# EAGLE schematic prism (EAGLE 6.5.0)
Assembly variants: Master Xbee, Slave
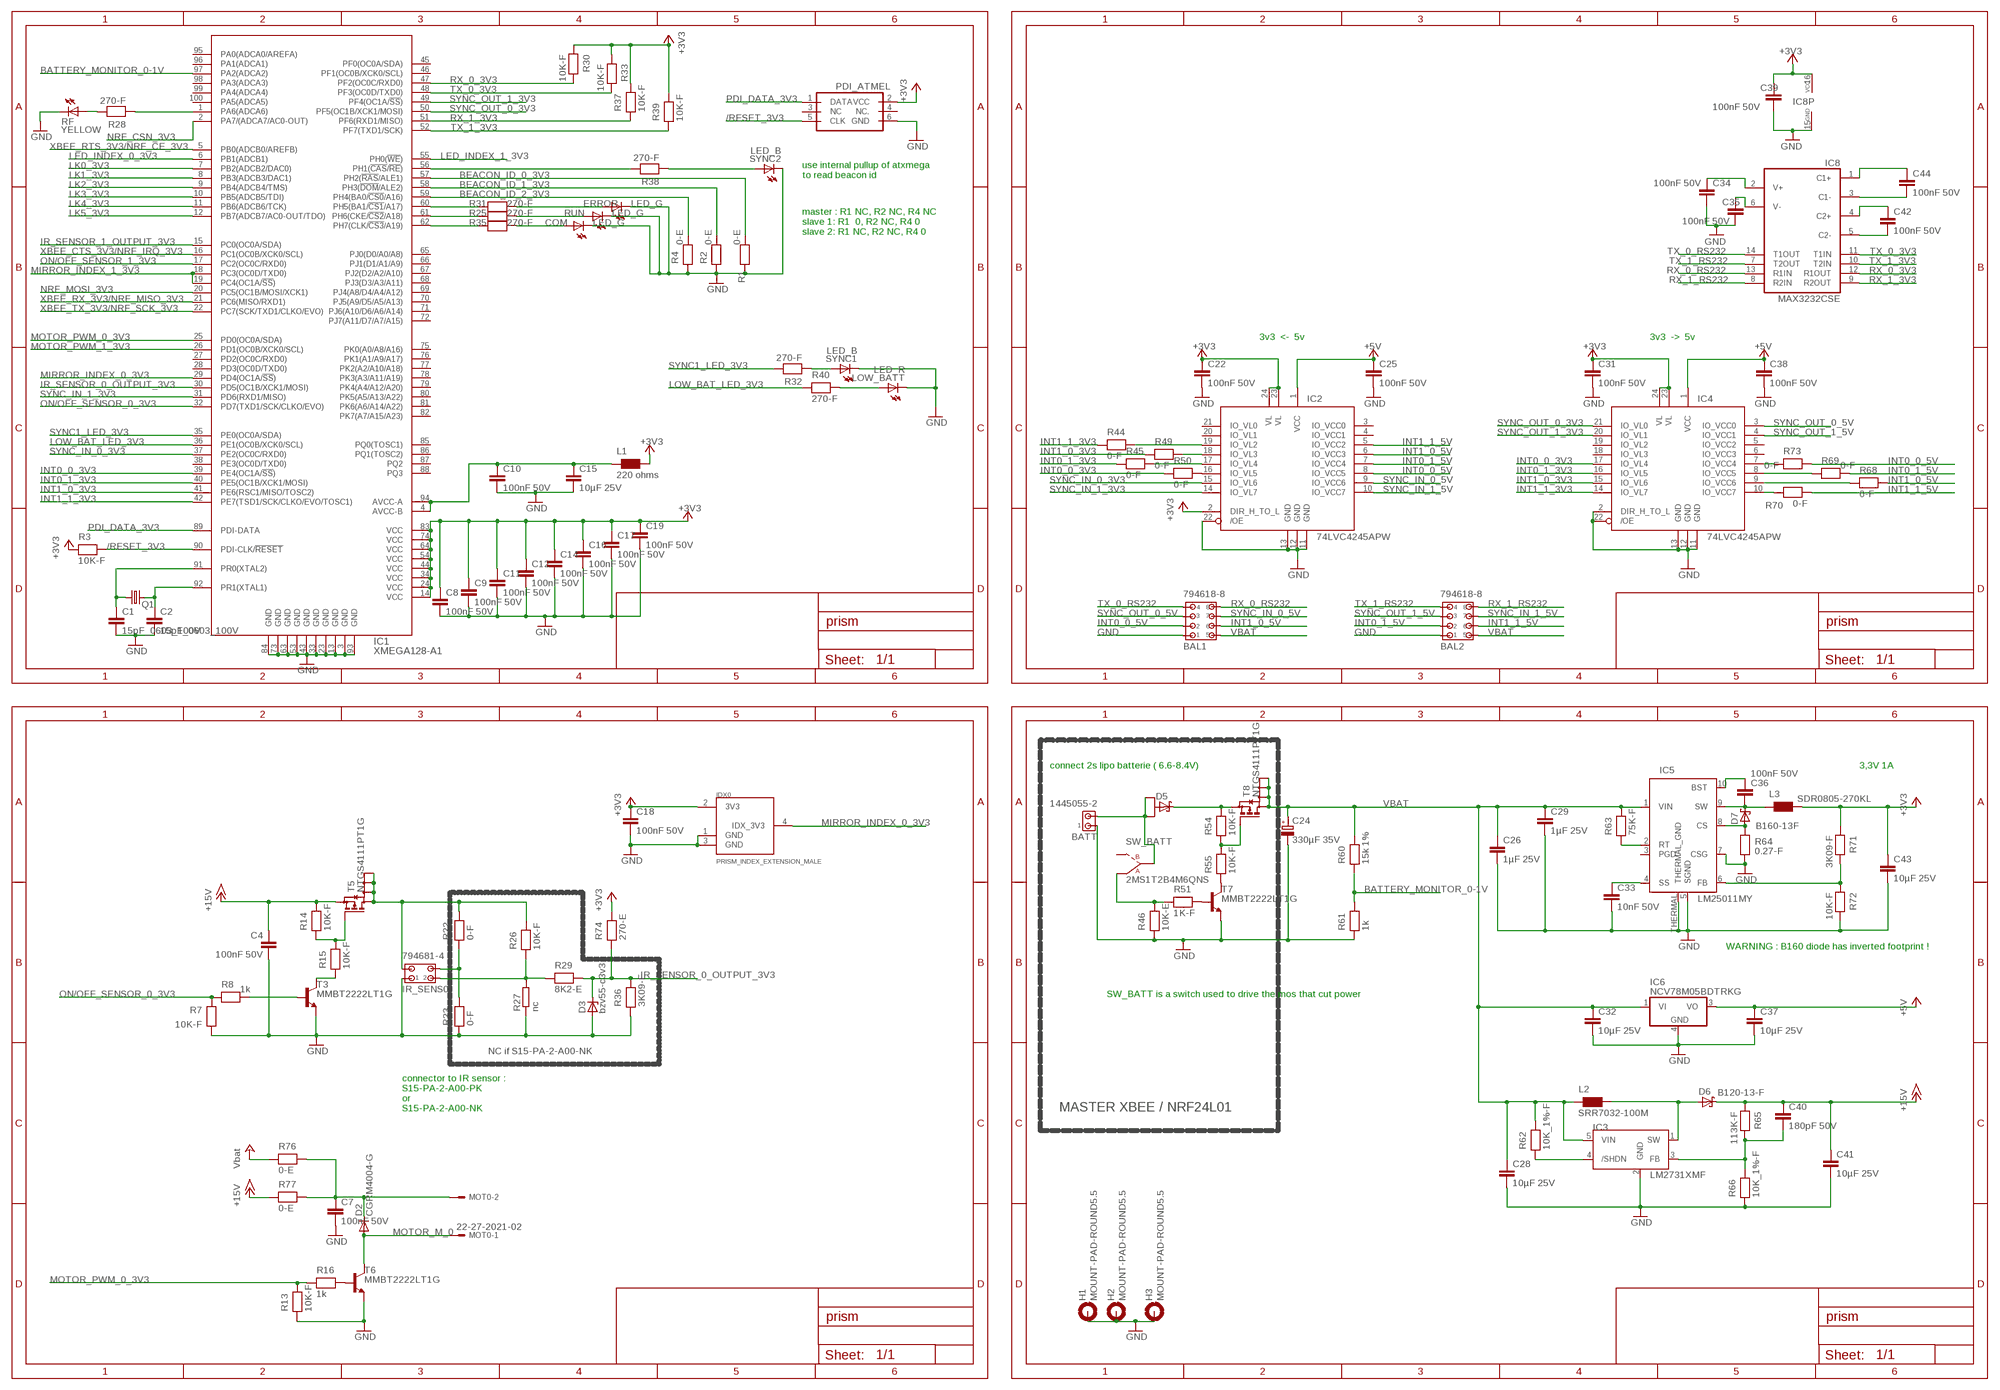
[diagram p0: schematic, sheet 1, part 1 of 2]
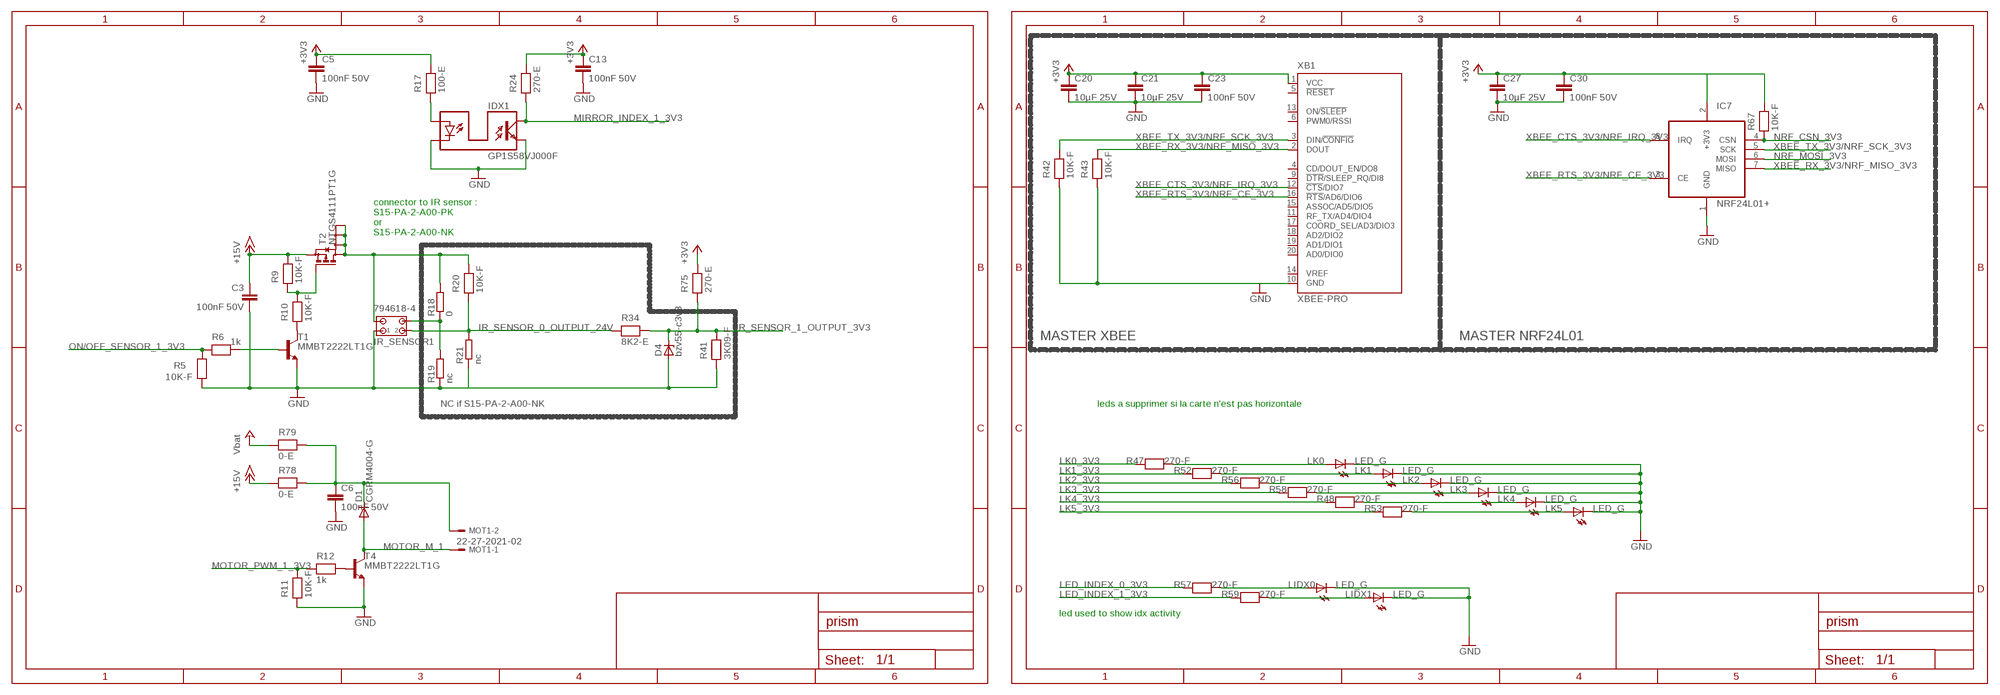
[diagram p1: schematic, sheet 1, part 2 of 2]

## Parts
BAL1  794618-8  [794618-8]
BAL2  794618-8  [794618-8]
BATT  1445055-2  [1445055-2]  (not fitted in variant Master Xbee)  (not fitted in variant Slave)
C1  15pF_0603_100V  15PF-F  [C0603]
C2  15pF_0603_100V  15PF-F  [C0603]
C3  100nF 50V  100NF-F  [C0603]
C4  100nF 50V  100NF-F  [C0603]
C5  100nF 50V  100NF-F  [C0603]
C6  100nF 50V  100NF-F  [C0603]
C7  100nF 50V  100NF-F  [C0603]
C8  100nF 50V  100NF-F  [C0603]
C9  100nF 50V  100NF-F  [C0603]
C10  100nF 50V  100NF-F  [C0603]
C11  100nF 50V  100NF-F  [C0603]
C12  100nF 50V  100NF-F  [C0603]
C13  100nF 50V  100NF-F  [C0603]
C14  100nF 50V  100NF-F  [C0603]
C15  10µF 25V  10UF-C_25V  [C1210]
C16  100nF 50V  100NF-F  [C0603]
C17  100nF 50V  100NF-F  [C0603]
C18  100nF 50V  100NF-F  [C0603]
C19  100nF 50V  100NF-F  [C0603]
C20  10µF 25V  10UF-C_25V  [C1210]  (not fitted in variant Slave)
C21  10µF 25V  10UF-C_25V  [C1210]  (not fitted in variant Slave)
C22  100nF 50V  100NF-F  [C0603]
C23  100nF 50V  100NF-F  [C0603]  (not fitted in variant Slave)
C24  330µF 35V  330UF  [PANASONIC_G]
C25  100nF 50V  100NF-F  [C0603]
C26  1µF 25V  1UFD_25V  [C1206]
C27  10µF 25V  10UF-C_25V  [C1210]  (not fitted in variant Master Xbee)  (not fitted in variant Slave)
C28  10µF 25V  10UF-C_25V  [C1210]
C29  1µF 25V  1UFD_25V  [C1206]
C30  100nF 50V  100NF-F  [C0603]  (not fitted in variant Master Xbee)  (not fitted in variant Slave)
C31  100nF 50V  100NF-F  [C0603]
C32  10µF 25V  10UF-C_25V  [C1210]
C33  10nF 50V  10NF-F  [C0603]
C34  100nF 50V  100NF-F  [C0603]
C35  100nF 50V  100NF-F  [C0603]
C36  100nF 50V  100NF-F  [C0603]
C37  10µF 25V  10UF-C_25V  [C1210]
C38  100nF 50V  100NF-F  [C0603]
C39  100nF 50V  100NF-F  [C0603]
C40  180pF 50V  180PF-F  [C0603]
C41  10µF 25V  10UF-C_25V  [C1210]
C42  100nF 50V  100NF-F  [C0603]
C43  10µF 25V  10UF-C_25V  [C1210]
C44  100nF 50V  100NF-F  [C0603]
COM  LED_G  [CHIP-LED0805]
D1  CGRM4004-G  [SOD-123_MINI-SMA]
D2  CGRM4004-G  [SOD-123_MINI-SMA]
D3  bzv55-c3v3  BZV55-C3V3SOD80C  [SOD80C]
D4  bzv55-c3v3  BZV55-C3V3SOD80C  [SOD80C]
D5  50WQ03  [TO252]  (not fitted in variant Slave)
D6  B120-13-F  [SMB]
D7  B160-13F  [SMA]
ERROR  LED_G  [CHIP-LED0805]
H1  MOUNT-PAD-ROUND5.5  [5,5-PAD]
H2  MOUNT-PAD-ROUND5.5  [5,5-PAD]
H3  MOUNT-PAD-ROUND5.5  [5,5-PAD]
IC1  XMEGA128-A1  XMEGA-A1TQFP  [TQFP100]
IC2  74LVC4245APW  [TSSOP24]
IC3  LM2731XMF  [SOT23-5]
IC4  74LVC4245APW  [TSSOP24]
IC5  LM25011MY  [MSOP10_THERMAL]
IC6  NCV78M05BDTRKG  [DPACK_3]
IC7  NRF24L01+  [NRF24L01+]  (not fitted in variant Master Xbee)  (not fitted in variant Slave)
IC8  MAX3232CSE  [SO16]
IDX0  PRISM_INDEX_EXTENSION_MALE  [PRISM_INDEX_EXTENSION_MALE]
IDX1  GP1S58VJ000F  [GP1S58VJ000F]
IR_SENS0  794681-4  [794681-4]
IR_SENSOR1  794618-4  [794618-4]
L1  220 ohms  FERRITE_220OHMS  [R0603]
L2  SRR7032-100M  [SRR7032]
L3  SDR0805-270KL  [SDR0805]
LIDX0  LED_G  [CHIP-LED0805]
LIDX1  LED_G  [CHIP-LED0805]
LK0  LED_G  [CHIP-LED0805]
LK1  LED_G  [CHIP-LED0805]
LK2  LED_G  [CHIP-LED0805]
LK3  LED_G  [CHIP-LED0805]
LK4  LED_G  [CHIP-LED0805]
LK5  LED_G  [CHIP-LED0805]
LOW_BATT  LED_R  [CHIP-LED0805]
MOT0  22-27-2021-02  [6410-02]
MOT1  22-27-2021-02  [6410-02]
PDI_ATMEL  PDI_ATMELL  [ML6L]
Q1  CRYSTAL_16MHZ_HC49UP  [HC49UP]
R1  0-E  [R0805]
R2  0-E  [R0805]
R3  10K-F  [R0603]
R4  0-E  [R0805]
R5  10K-F  [R0603]
R6  1k  1K-F  [R0603]
R7  10K-F  [R0603]
R8  1k  1K-F  [R0603]
R9  10K-F  [R0603]
R10  10K-F  [R0603]
R11  10K-F  [R0603]
R12  1k  1K-F  [R0603]
R13  10K-F  [R0603]
R14  10K-F  [R0603]
R15  10K-F  [R0603]
R16  1k  1K-F  [R0603]
R17  100-E  [R0805]
R18  0  R-EU_R0603  [R0603]
R19  nc  R-EU_R0603  [R0603]
R20  10K-F  [R0603]
R21  nc  R-EU_R0603  [R0603]
R22  0-F  [R0603]
R23  0-F  [R0603]
R24  270-E  [R0805]
R25  270-F  [R0603]
R26  10K-F  [R0603]
R27  nc  R-EU_R0603  [R0603]
R28  270-F  [R0603]
R29  8K2-E  [R0805]
R30  10K-F  [R0603]
R31  270-F  [R0603]
R32  270-F  [R0603]
R33  10K-F  [R0603]
R34  8K2-E  [R0805]
R35  270-F  [R0603]
R36  3K09-F  [R0603]
R37  10K-F  [R0603]
R38  270-F  [R0603]
R39  10K-F  [R0603]
R40  270-F  [R0603]
R41  3K09-F  [R0603]
R42  10K-F  [R0603]  (not fitted in variant Slave)
R43  10K-F  [R0603]  (not fitted in variant Slave)
R44  0-F  [R0603]
R45  0-F  [R0603]
R46  10K-E  [R0805]  (not fitted in variant Slave)
R47  270-F  [R0603]
R48  270-F  [R0603]
R49  0-F  [R0603]
R50  0-F  [R0603]
R51  1K-F  [R0603]  (not fitted in variant Slave)
R52  270-F  [R0603]
R53  270-F  [R0603]
R54  10K-F  [R0603]  (not fitted in variant Slave)
R55  10K-F  [R0603]  (not fitted in variant Slave)
R56  270-F  [R0603]
R57  270-F  [R0603]
R58  270-F  [R0603]
R59  270-F  [R0603]
R60  15k 1%  15K-E  [R0805]
R61  1k  1K-E  [R0805]
R62  10K_1%-F  [R0603]
R63  75K-F  [R0603]
R64  0.27-F  [R0603]
R65  113K-F  [R0603]
R66  10K_1%-F  [R0603]
R67  10K-F  [R0603]  (not fitted in variant Master Xbee)  (not fitted in variant Slave)
R68  0-F  [R0603]
R69  0-F  [R0603]
R70  0-F  [R0603]
R71  3K09-F  [R0603]
R72  10K-F  [R0603]
R73  0-F  [R0603]
R74  270-E  [R0805]
R75  270-E  [R0805]
R76  0-E  [R0805]  (not fitted in variant Master Xbee)  (not fitted in variant Slave)
R77  0-E  [R0805]
R78  0-E  [R0805]
R79  0-E  [R0805]  (not fitted in variant Master Xbee)  (not fitted in variant Slave)
RF  YELLOW  LED_Y  [CHIP-LED0805]
RUN  LED_G  [CHIP-LED0805]
SW_BATT  2MS1T2B4M6QNS  [2MS1T2B4M6QNS]  (not fitted in variant Slave)
SYNC1  LED_B  [CHIP-LED0805]
SYNC2  LED_B  [CHIP-LED0805]
T1  MMBT2222LT1G  MMBT2222ALT1-NPN-SOT23-BEC  [SOT23-BEC]
T2  NTGS4111PT1G  [TSOP-6]
T3  MMBT2222LT1G  MMBT2222ALT1-NPN-SOT23-BEC  [SOT23-BEC]
T4  MMBT2222LT1G  MMBT2222ALT1-NPN-SOT23-BEC  [SOT23-BEC]
T5  NTGS4111PT1G  [TSOP-6]
T6  MMBT2222LT1G  MMBT2222ALT1-NPN-SOT23-BEC  [SOT23-BEC]
T7  MMBT2222LT1G  MMBT2222ALT1-NPN-SOT23-BEC  [SOT23-BEC]
T8  NTGS4111PT1G  [TSOP-6]  (not fitted in variant Slave)
XB1  XBEE-PRO  [XBEE-PRO]  (not fitted in variant Slave)

## Nets
+3V3: C5.1 C8.1 C9.1 C11.1 C12.1 C13.1 C14.1 C16.1 C17.1 C18.1 C19.1 C20.1 C21.1 C22.1 C23.1 C27.1 C30.1 C31.1 C39.1 C43.1 IC1.14(VCC) IC1.24(VCC) IC1.34(VCC) IC1.44(VCC) IC1.54(VCC) IC1.64(VCC) IC1.74(VCC) IC1.83(VCC) IC2.2(DIR_H_TO_L) IC2.23(VL) IC2.24(VL) IC4.23(VL) IC4.24(VL) IC7.2(+3V3) IC8.16(VCC) IDX0.2(3V3) L1.2 L3.2 PDI_ATMEL.2(VCC) R3.1 R17.2 R24.2 R30.1 R33.1 R37.2 R39.2 R67.2 R71.1 R74.2 R75.2 XB1.1(VCC)
+5V: C25.1 C37.1 C38.1 IC2.1(VCC) IC4.1(VCC) IC6.3(VO)
+15V: C3.1 C4.1 C40.1 C41.1 D6.C R9.2 R14.2 R65.1 R77.1 R78.1 T2.4(S) T5.4(S)
/RESET_3V3: IC1.90(PDI-CLK/!RESET) PDI_ATMEL.5(CLK) R3.2
BATTERY_MONITOR_0-1V: IC1.97(PA2(ADCA2)) R60.1 R61.2
BEACON_ID_0_3V3: IC1.57(PH2(!RAS!/ALE1)) R1.2
BEACON_ID_1_3V3: IC1.58(PH3(!DOM!/ALE2)) R2.2
BEACON_ID_2_3V3: IC1.59(PH4(BA0/!CS0!/A16)) R4.2
GND: BAL1.1 BAL2.1 BATT.1 C1.2 C2.2 C3.2 C4.2 C5.2 C6.2 C7.2 C8.2 C9.2 C10.2 C11.2 C12.2 C13.2 C14.2 C15.2 C16.2 C17.2 C18.2 C19.2 C20.2 C21.2 C22.2 C23.2 C24.- C25.2 C26.2 C27.2 C28.2 C29.2 C30.2 C31.2 C32.2 C33.2 C34.2 C35.2 C37.2 C38.2 C39.2 C41.2 C43.2 COM.C D3.A D4.A ERROR.C H1.B5,5(MOUNT) H2.B5,5(MOUNT) H3.B5,5(MOUNT) IC1.3(GND) IC1.13(GND) IC1.23(GND) IC1.33(GND) IC1.43(GND) IC1.53(GND) IC1.63(GND) IC1.73(GND) IC1.84(GND) IC1.93(GND) IC2.11(GND) IC2.12(GND) IC2.13(GND) IC2.22(/OE) IC3.2(GND) IC4.2(DIR_H_TO_L) IC4.11(GND) IC4.12(GND) IC4.13(GND) IC4.22(/OE) IC5.5(SGND) IC5.7(CSG) IC5.THERMAL(THERMAL_GND) IC6.4(GND) IC7.1(GND) IC8.15(GND) IDX0.1(GND) IDX0.3(GND) IDX1.LED_C IDX1.TRANSISTOR_E IR_SENS0.1 IR_SENSOR1.1 LIDX0.C LIDX1.C LK0.C LK1.C LK2.C LK3.C LK4.C LK5.C LOW_BATT.C PDI_ATMEL.6(GND) R1.1 R2.1 R4.1 R5.1 R7.1 R11.1 R13.1 R19.1 R21.1 R23.1 R27.1 R36.1 R41.1 R42.1 R43.1 R46.1 R61.1 R64.1 R66.1 R72.2 RF.C RUN.C SYNC1.C SYNC2.C T1.E T3.E T4.E T6.E T7.E XB1.10(GND)
INT0_0_3V3: IC1.39(PE4(OC1A/!SS!)) IC4.17(IO_VL4) R50.1
INT0_0_5V: BAL1.2 IC2.8(IO_VCC5) R73.2
INT0_1_3V3: IC1.40(PE5(OC1B/XCK1/MOSI)) IC4.16(IO_VL5) R45.1
INT0_1_5V: BAL2.2 IC2.7(IO_VCC4) R69.2
INT1_0_3V3: IC1.41(PE6(RSC1/MISO/TOSC2)) IC4.15(IO_VL6) R49.1
INT1_0_5V: BAL1.6 IC2.6(IO_VCC3) R68.2
INT1_1_3V3: IC1.42(PE7(TSD1/SCK/CLKO/EVO/TOSC1)) IC4.14(IO_VL7) R44.1
INT1_1_5V: BAL2.6 IC2.5(IO_VCC2) R70.2
IR_SENSOR_0_OUTPUT_3V3: D3.C IC1.30(PD5(OC1B/XCK1/MOSI)) R29.2 R36.2 R74.1
IR_SENSOR_0_OUTPUT_24V: IR_SENSOR1.2 R20.1 R21.2 R34.1
IR_SENSOR_1_OUTPUT_3V3: D4.C IC1.15(PC0(OC0A/SDA)) R34.2 R41.2 R75.1
IR_SENSOR_1_OUTPUT_24V: IR_SENS0.2 R26.1 R27.2 R29.1
LED_INDEX_0_3V3: IC1.6(PB1(ADCB1)) R57.1
LED_INDEX_1_3V3: IC1.55(PH0(!WE!)) R59.1
LK0_3V3: IC1.7(PB2(ADCB2/DAC0)) R47.1
LK1: LK2.A R56.2
LK1_3V3: IC1.8(PB3(ADCB3/DAC1)) R52.1
LK2_3V3: IC1.9(PB4(ADCB4/TMS)) R56.1
LK3_3V3: IC1.10(PB5(ADCB5/TDI)) R58.1
LK4_3V3: IC1.11(PB6(ADCB6/TCK)) R48.1
LK5: LIDX0.A R57.2
LK5_3V3: IC1.12(PB7(ADCB7/AC0-OUT/TDO)) R53.1
LOW_BAT_LED_3V3: IC1.36(PE1(OC0B/XCK0/SCL)) R40.1
MIRROR_INDEX_0_3V3: IC1.29(PD4(OC1A/!SS!)) IDX0.4(IDX_3V3)
MIRROR_INDEX_1_3V3: IC1.18(PC3(OC0D/TXD0)) IC1.19(PC4(OC1A/!SS!)) IDX1.TRANSISTOR_C R24.1
MOTOR_M_0: D2.A MOT0.1 T6.C
MOTOR_M_1: D1.A MOT1.1 T4.C
MOTOR_PWM_0_3V3: IC1.25(PD0(OC0A/SDA)) R13.2 R16.1
MOTOR_PWM_1_3V3: IC1.26(PD1(OC0B/XCK0/SCL)) R11.2 R12.1
N$1: C44.1 IC8.1(C1+)
N$2: R25.2 RUN.A
N$3: R12.2 T4.B
N$4: ERROR.A R31.2
N$5: C44.2 IC8.3(C1-)
N$6: C42.1 IC8.4(C2+)
N$7: COM.A R35.2
N$8: C10.1 C15.1 IC1.4(AVCC-B) IC1.94(AVCC-A) L1.1
N$9: IC1.61(PH6(CKE/!CS2!/A18)) R25.1
N$10: IC1.60(PH5(BA1/!CS1!/A17)) R31.1
N$11: C34.1 IC8.2(V+)
N$12: IC1.62(PH7(CLK/!CS3!/A19)) R35.1
N$13: C35.1 IC8.6(V-)
N$14: R14.1 R15.2 T5.3(G)
N$16: R8.2 T3.B
N$17: R15.1 T3.C
N$18: R16.2 T6.B
N$19: LK0.A R47.2
N$20: LK1.A R52.2
N$22: LK3.A R58.2
N$23: BATT.2 D5.1(A1) D5.3(A2) SW_BATT.2
N$24: C42.2 IC8.5(C2-)
N$25: R51.2 T7.B
N$26: R54.1 R55.2 T8.3(G)
N$27: R28.2 RF.A
N$28: IC1.1(PA6(ADCA6)) R28.1
N$29: R55.1 T7.C
N$30: D5.4(C) R54.2 T8.4(S)
N$31: IC1.56(PH1(!CAS!/!RE!)) R38.2
N$33: R38.1 SYNC2.A
N$34: LOW_BATT.A R40.2
N$35: R32.1 SYNC1.A
N$37: R6.2 T1.B
N$38: C36.2 D7.C IC5.9(SW) L3.1
N$39: D7.A IC5.8(CS) R64.2
N$40: IC5.2(RT) R63.1
N$41: IR_SENS0.4 R22.1 R23.2
N$42: R10.1 T1.C
N$43: C33.1 IC5.4(SS)
N$44: IC5.6(FB) R71.2 R72.1
N$45: C1.1 IC1.91(PR0(XTAL2)) Q1.1
N$46: C2.1 IC1.92(PR1(XTAL1)) Q1.2
N$47: IC4.10(IO_VCC7) R70.1
N$48: C36.1 IC5.10(BST)
N$49: IC2.19(IO_VL2) R44.2
N$50: IC2.17(IO_VL4) R45.2
N$51: IC2.18(IO_VL3) R49.2
N$52: IC2.16(IO_VL5) R50.2
N$53: IC4.9(IO_VCC6) R68.1
N$54: IC4.7(IO_VCC4) R73.1
N$55: IC4.8(IO_VCC5) R69.1
N$56: IR_SENSOR1.3 R18.2 R20.2 T2.1(D) T2.2(D) T2.5(D) T2.6(D)
N$57: IDX1.LED_A R17.1
N$58: IR_SENS0.3 R22.2 R26.2 T5.1(D) T5.2(D) T5.5(D) T5.6(D)
N$59: D6.A IC3.1(SW) L2.2
N$60: C40.2 IC3.3(FB) R65.2 R66.2
N$63: IC3.4(/SHDN) R62.1
N$91: LK4.A R48.2
N$92: LK5.A R53.2
N$94: LIDX1.A R59.2
N$128: R9.1 R10.2 T2.3(G)
N$129: IR_SENSOR1.4 R18.1 R19.2
NRF_CSN_3V3: IC1.2(PA7/(ADCA7/AC0-OUT)) IC7.4(CSN) R67.1
NRF_MOSI_3V3: IC1.20(PC5(OC1B/MOSI/XCK1)) IC7.6(MOSI)
ON/OFF_SENSOR_0_3V3: IC1.32(PD7(TXD1/SCK/CLKO/EVO)) R7.2 R8.1
ON/OFF_SENSOR_1_3V1: R46.2 R51.1 SW_BATT.3
ON/OFF_SENSOR_1_3V3: IC1.17(PC2(OC0C/RXD0)) R5.2 R6.1
PDI_DATA_3V3: IC1.89(PDI-DATA) PDI_ATMEL.1(DATA)
RX_0_3V3: IC1.47(PF2(OC0C/RXD0)) IC8.12(R1OUT) R30.2
RX_0_RS232: BAL1.8 IC8.13(R1IN)
RX_1_3V3: IC1.51(PF6(RXD1/MISO)) IC8.9(R2OUT) R37.1
RX_1_RS232: BAL2.8 IC8.8(R2IN)
SYNC1_LED_3V3: IC1.35(PE0(OC0A/SDA)) R32.2
SYNC_IN_0_3V3: IC1.37(PE2(OC0C/RXD0)) IC2.15(IO_VL6)
SYNC_IN_0_5V: BAL1.7 IC2.9(IO_VCC6)
SYNC_IN_1_3V3: IC1.31(PD6(RXD1/MISO)) IC2.14(IO_VL7)
SYNC_IN_1_5V: BAL2.7 IC2.10(IO_VCC7)
SYNC_OUT_0_3V3: IC1.50(PF5(OC1B/XCK1/MOSI)) IC4.21(IO_VL0)
SYNC_OUT_0_5V: BAL1.3 IC4.3(IO_VCC0)
SYNC_OUT_1_3V3: IC1.49(PF4(OC1A/!SS!)) IC4.20(IO_VL1)
SYNC_OUT_1_5V: BAL2.3 IC4.4(IO_VCC1)
TX_0_3V3: IC1.48(PF3(OC0D/TXD0)) IC8.11(T1IN) R33.2
TX_0_RS232: BAL1.4 IC8.14(T1OUT)
TX_1_3V3: IC1.52(PF7(TXD1/SCK)) IC8.10(T2IN) R39.1
TX_1_RS232: BAL2.4 IC8.7(T2OUT)
VBAT: BAL1.5 BAL2.5 C24.+ C26.1 C28.1 C29.1 C32.1 IC3.5(VIN) IC5.1(VIN) IC6.1(VI) L2.1 R60.2 R62.2 R63.2 R76.1 R79.1 T8.1(D) T8.2(D) T8.5(D) T8.6(D) ; supply symbol labelled Vbat
VCC_MOT0: C7.1 D2.C MOT0.2 R76.2 R77.2
VCC_MOT1: C6.1 D1.C MOT1.2 R78.2 R79.2
XBEE_CTS_3V3/NRF_IRQ_3V3: IC1.16(PC1(OC0B/XCK0/SCL)) IC7.8(IRQ) XB1.12(!CTS!/DIO7)
XBEE_RTS_3V3/NRF_CE_3V3: IC1.5(PB0(ADCB0/AREFB)) IC7.3(CE) XB1.16(!RTS!/AD6/DIO6)
XBEE_RX_3V3/NRF_MISO_3V3: IC1.21(PC6(MISO/RXD1)) IC7.7(MISO) R43.2 XB1.2(DOUT)
XBEE_TX_3V3/NRF_SCK_3V3: IC1.22(PC7(SCK/TXD1/CLKO/EVO)) IC7.5(SCK) R42.2 XB1.3(DIN/!CONFIG)
Unconnected: IC1.27(PD2(OC0C/RXD0)) IC1.28(PD3(OC0D/TXD0)) IC1.38(PE3(OC0D/TXD0)) IC1.45(PF0(OC0A/SDA)) IC1.46(PF1(OC0B/XCK0/SCL)) IC1.65(PJ0(D0/A0/A8)) IC1.66(PJ1(D1/A1/A9)) IC1.67(PJ2(D2/A2/A10)) IC1.68(PJ3(D3/A3/A11)) IC1.69(PJ4(A8/D4/A4/A12)) IC1.70(PJ5(A9/D5/A5/A13)) IC1.71(PJ6(A10/D6/A6/A14)) IC1.72(PJ7(A11/D7/A7/A15)) IC1.75(PK0(A0/A8/A16)) IC1.76(PK1(A1/A9/A17)) IC1.77(PK2(A2/A10/A18)) IC1.78(PK3(A3/A11/A19)) IC1.79(PK4(A4/A12/A20)) IC1.80(PK5(A5/A13/A22)) IC1.81(PK6(A6/A14/A22)) IC1.82(PK7(A7/A15/A23)) IC1.85(PQ0(TOSC1)) IC1.86(PQ1(TOSC2)) IC1.87(PQ2) IC1.88(PQ3) IC1.95(PA0(ADCA0/AREFA)) IC1.96(PA1(ADCA1)) IC1.98(PA3(ADCA3)) IC1.99(PA4(ADCA4)) IC1.100(PA5(ADCA5)) IC2.3(IO_VCC0) IC2.4(IO_VCC1) IC2.20(IO_VL1) IC2.21(IO_VL0) IC4.5(IO_VCC2) IC4.6(IO_VCC3) IC4.18(IO_VL3) IC4.19(IO_VL2) IC5.3(PGD) PDI_ATMEL.3(NC) PDI_ATMEL.4(NC.) SW_BATT.1 XB1.4(CD/DOUT_EN/DO8) XB1.5(!RESET) XB1.6(PWM0/RSSI) XB1.9(!DTR!/SLEEP_RQ/DI8) XB1.11(RF_TX/AD4/DIO4) XB1.13(ON/!SLEEP) XB1.14(VREF) XB1.15(ASSOC/AD5/DIO5) XB1.17(COORD_SEL/AD3/DIO3) XB1.18(AD2/DIO2) XB1.19(AD1/DIO1) XB1.20(AD0/DIO0)

## Notes on the sheet
- use internal pullup of atxmega
  to read beacon id
- master : R1 NC, R2 NC, R4 NC
  slave 1: R1  0, R2 NC, R4 0
  slave 2: R1 NC, R2 NC, R4 0
- 3v3  <-  5v | 3v3  ->  5v
- connect 2s lipo batterie ( 6.6-8.4V) | 3,3V 1A
- WARNING : B160 diode has inverted footprint !
- SW_BATT is a switch used to drive the mos that cut power
- NC if S15-PA-2-A00-NK
- connector to IR sensor : 
  S15-PA-2-A00-PK
  or 
  S15-PA-2-A00-NK
- MASTER XBEE / NRF24L01
- connector to IR sensor : 
  S15-PA-2-A00-PK
  or 
  S15-PA-2-A00-NK
- MASTER XBEE | MASTER NRF24L01
- NC if S15-PA-2-A00-NK | leds a supprimer si la carte n'est pas horizontale
- led used to show idx activity

## Library data of the parts
BAL1 BAL2 = robotter_connector:794618-8; MOUSER: 571-3-794618-8; RS: 495-9451
BATT = robotter_connector:1445055-2: Micro MATE-N-LOK Connectors grid 1.5 mm Source: ENG_CD_1445055_A.pdf; MOUSER: 571-2-1445055-2; RS: 495-9580
C1 C2 = robotter_capacitor:15PF; MOUSER: 581-06031A150K4T2A; RS: 147-421
C3-C14 C16-C19 C22 C23 C25 C30 C31 C34-C36 C38 C39 C42 C44 = robotter_capacitor:100NF; MOUSER: 81-GRM188F51H104ZA01; RS: 723-5534
C15 C20 C21 C27 C28 C32 C37 C41 C43 = robotter_capacitor:10UF; MOUSER: 963-TMK316BJ106KL-T; RS: 766-1185
C24 = robotter_capacitor:330UF; MANUFACTURER: EEEFK1V331P; MOUSER: 667-EEE-FK1V331P; RS: 708-3475
C26 C29 = robotter_capacitor:1UF; MOUSER: 810-C3216X7R1E105K-6; RS: 740-7574
C33 = robotter_capacitor:10NF; MOUSER: 81-GCM188R71H103KA7D; RS: 723-4982
C40 = robotter_capacitor:180PF; MOUSER: 77-VJ0603A181GXACBC; RS: 147-213
COM ERROR LIDX0 LIDX1 LK0 LK1-LK5 RUN = robotter_diode:LED_; MOUSER: 859-LTST-C171GKT; RS: 692-0935; VALUE: GREEN
D1 D2 = robotter_diode:CGRM400*-G: Molded plasitc,JEDEC SOD-123/Mini SMA Source: Comchip CGRM4001-G.pdf; MOUSER: 863-MRA4004T3G; RS: 545-2456; VALUE: MRA4004T3G
D3 D4 = robotter_diode:BZV55-C3V3: Z-Diode; MOUSER: 771-BZV55-C3V3T/R; RS: 748-5029
D5 = robotter_diode:50WQ03; MOUSER: 844-50WQ03FNPBF; RS: 302-167; VALUE: 50WQ03
D6 = robotter_diode:B120-13-F; MOUSER: 621-B120-F; RS: 751-3174
D7 = robotter_diode:B160-13F; MOUSER: 621-B160-F; RS: 738-4765
H1-H3 = holes:MOUNT-PAD-ROUND: MOUNTING PAD, round
IC1 = avr-7:XMEGA-A1: Atmel XMega A1 Series processor
IC2 IC4 = robotter_ic:74LVC4245: octal transceiver buffer; MOUSER: 771-74LVC4245APW-T; RS: 380-0500
IC3 = robotter_ic:LM2731; MOUSER: 926-LM2731XMF/NOPB; RS: 533-5418
IC5 = robotter_ic:LM25011: 42V 2A step down switching regulator http://www.ti.com/product/lm25011; MOUSER: 926-LM25011MY/NOPB; RS: 761-4883
IC6 = robotter_ic:NCV78M: 500 mA Positive Voltage Regulators Source: Data sheet <http://www.onsemi.com/pub_link/Collateral/MC78M00-D.PDF>; MOUSER: 863-NCV78M05BDTRKG; RS: 785-7443
IC7 = robotter_ic:NRF24L01+
IC8 = robotter_ic:MAX3232: True RS-232 Transceivers 3.0V to 5.5V, Low-Power up to 1Mbps, Using Four 0.1µF External Capacitors Source: http://pdfserv.maxim-ic.com/en/ds/MAX3222-MAX3241.pdf; MOUSER: 511-ST3232CDR; RS: 415-2105
IDX0 = robotter_others:PRISM_INDEX_EXTENSION
IDX1 = robotter_ic:GP1S58VJ000F: photo interrupter; MOUSER: 852-GP1S58VJ000F; RS: 667-5039
IR_SENS0 = robotter_connector:794681-4: Micro MATE-N-LOK Connectors grid 1.5mm Dual Row Through Hole Vertical Metal Through Hole Holddowns Source: ENG_CD_794681_E.pdf; MOUSER: 571-3-794630-4; RS: 495-9344; VALUE: 794630-4
IR_SENSOR1 = robotter_connector:794618-4; MOUSER: 571-3-794618-4; RS: 495-9439
L1 = robotter_inductor:FERRITE_220OHMS; MOUSER: 81-BLM18BB221SN1D; RS: 724-1302
L2 = robotter_inductor:SRR7032; MOUSER: 652-SRR7032-100M; RS: 727-2101; VALUE: 10µH
L3 = robotter_inductor:SDR0805; MOUSER: 652-SDR0805-270KL; RS: 736-1282
LOW_BATT = robotter_diode:LED_; MOUSER: 859-LTST-C171EKT; RS: 692-0931; VALUE: RED
MOT0 MOT1 = robotter_connector:22-?-02: CONNECTOR wire to board 2.54 mm (.1 inch) pitch header; MOUSER: 538-22-27-2021; RS: 483-8461
PDI_ATMEL = robotter_connector:PDI_ATMEL: Ref Harting : 09 18 506 7323 Atmel pdi connector; MOUSER: 617-09-18-506-7323; RS: 693-5242
Q1 = robotter_ic:CRYSTAL_: CRYSTAL; MOUSER: 559-FOXSD160-20-LF; RS: 547-6531; VALUE: 16 MHz
R1 R2 R4 R22 R23 R44 R45 R49 R50 R68-R70 R73 R76-R79 = robotter_resistor:0
R3 R5 R7 R9-R11 R13-R15 R20 R26 R30 R33 R37 R39 R42 R43 R54 R55 R67 R72 = robotter_resistor:10K; MOUSER: 652-CR0603-JW-103ELF; RS: 740-8899
R6 R8 R12 R16 = robotter_resistor:1K; MOUSER: 71-CRCW0603-1.0K-E3; RS: 213-2266
R17 = robotter_resistor:100; MOUSER: 603-AF0805FR-07100RL; RS: 223-0297
R18 R19 R21 R27 = rcl:R-EU_: RESISTOR, European symbol
R24 R74 R75 = robotter_resistor:270; MOUSER: 660-RK73H2ATTD2700F; RS: 740-9019
R25 R28 R31 R32 R35 R38 R40 R47 R48 R52 R53 R56-R59 = robotter_resistor:270; MOUSER: 71-CRCW0603J-270-E3; RS: 679-0071
R29 R34 = robotter_resistor:8K2; MOUSER: 71-CRCW08058K20FKEB; RS: 679-1727
R36 R41 R71 = robotter_resistor:3K09; MOUSER: 667-ERA-3AEB3091V; RS: 708-7574
R46 = robotter_resistor:10K; MOUSER: 71-CRCW080510K0FKEB; RS: 740-9072
R51 = robotter_resistor:1K; MOUSER: 71-CRCW0603-1.0K-E3; RS: 213-2266; VALUE: 1k
R60 = robotter_resistor:15K; MOUSER: 660-RK73H2ATTD1502F; RS: 740-8997
R61 = robotter_resistor:1K; MOUSER: 71-CRCW0805-1.0K-E3; RS: 223-0427
R62 R66 = robotter_resistor:10K_1%; MOUSER: 603-AF0603FR-0710KL; RS: 740-8805
R63 = robotter_resistor:75K; MOUSER: 660-RK73H1JTTD7502F; RS: 679-0695
R64 = robotter_resistor:0.27; MOUSER: 603-RL0603FR070R27L; RS: 722-1046
R65 = robotter_resistor:113K; MOUSER: 71-CRCW0603-113K-E3; RS: 708-9035; VALUE: 113k 0.1%
RF = robotter_diode:LED_; MOUSER: 859-LTST-C170YKT; RS: 692-0925
SW_BATT = robotter_others:2MS1T2B4M6QNS; RS: 734-7220
SYNC1 SYNC2 = robotter_diode:LED_; MOUSER: 859-LTST-C171TBKT; RS: 692-0953; VALUE: BLUE
T1 T3 T4 T6 T7 = robotter_ic:*-NPN-: NPN Transistror; MOUSER: 863-MMBT2222ALT1G; RS: 544-9400; VALUE: mmbt2222
T2 T5 T8 = robotter_ic:NTGS4111; MOUSER: 863-NTGS4111PT1G; RS: 780-0567
XB1 = robotter_ic:XBEE: XBee (TM) /XBee-PRO(TM) OEM RF Modules Source: MaxStream, Inc. xbee_productmanual.pdf; FARNELL: 1337916; MPN: XBP24-AWI-001; OC_NEWARK: 42M2667; RS: 436-496